# Altium schematic sheet MCU_SoM.SchDoc
size A2; SheetNumber: 12; SheetTotal: 12
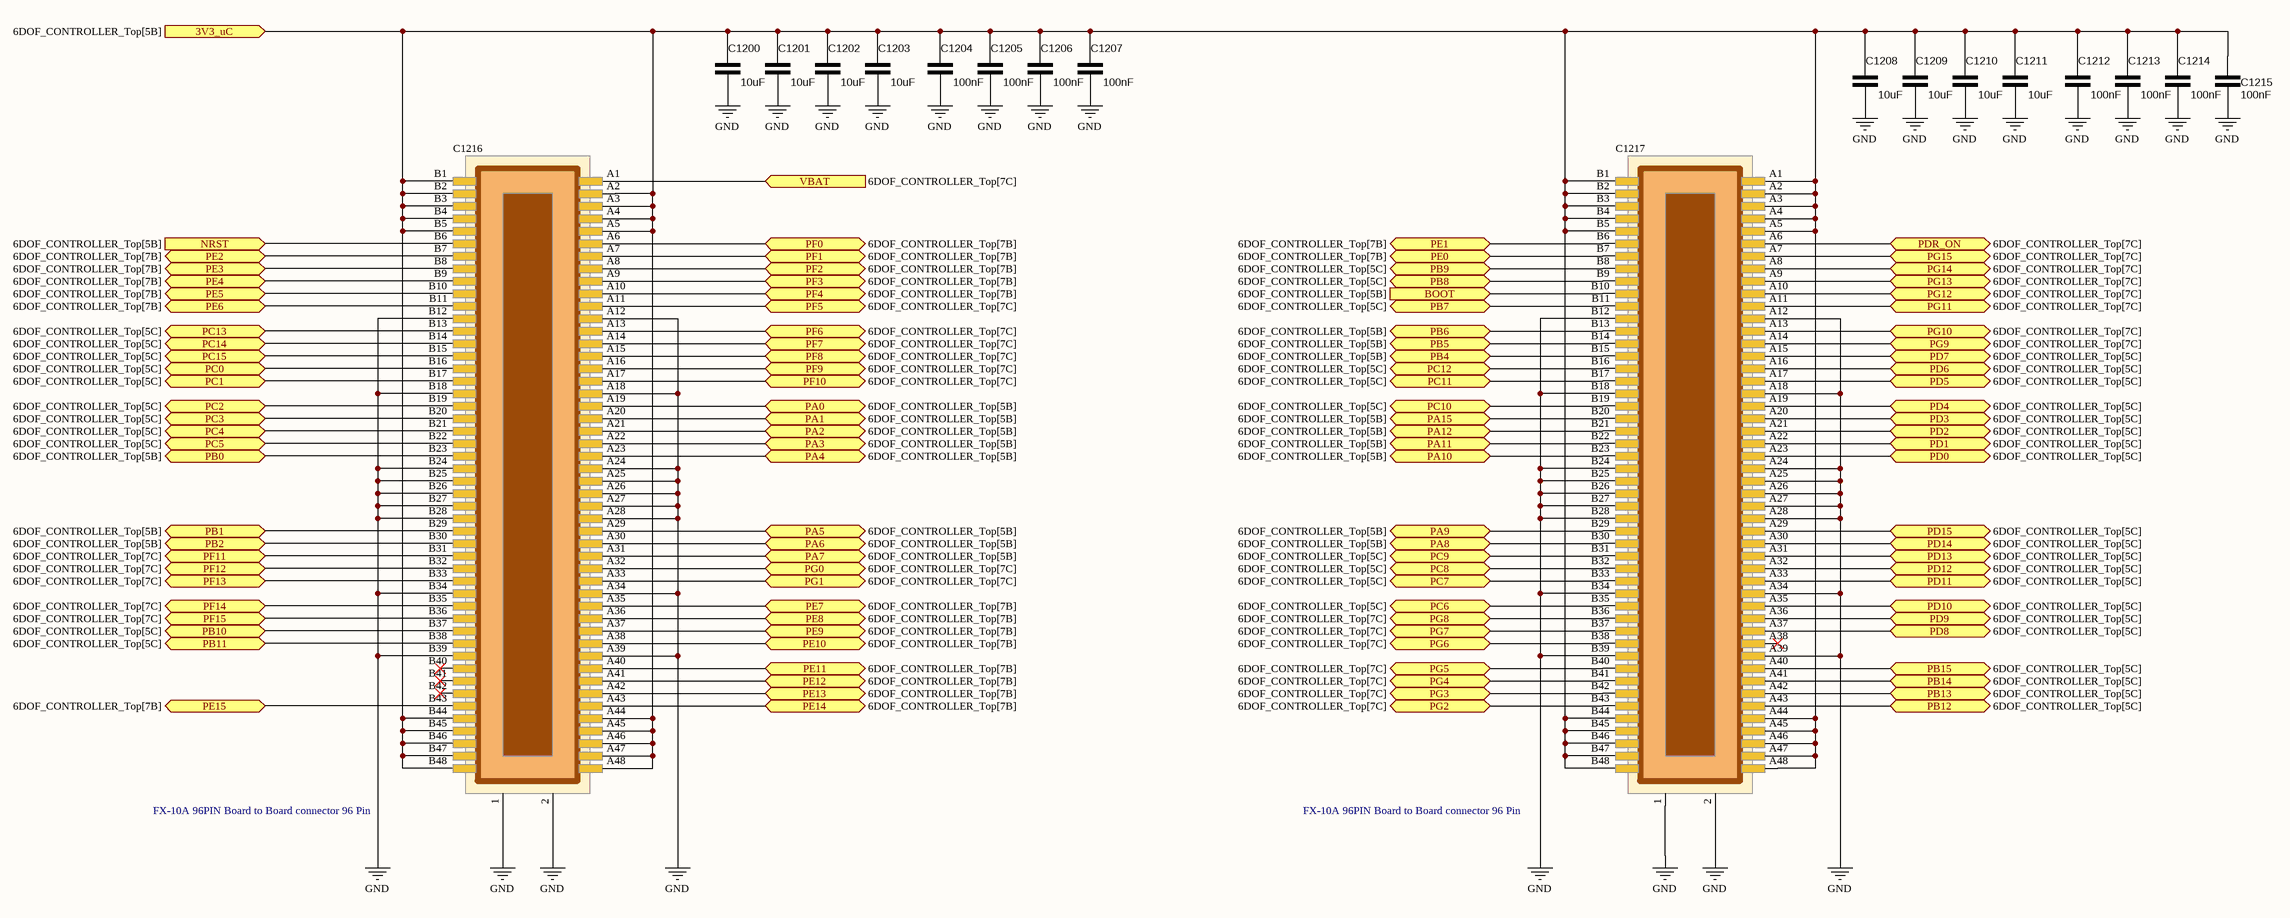
[diagram p0: MCU_SoM.SchDoc]

## Parts
C1200  10uF  [CAP_0805]
C1201  10uF  [CAP_0805]
C1202  10uF  [CAP_0805]
C1203  10uF  [CAP_0805]
C1204  100nF  [CAP_0603]
C1205  100nF  [CAP_0603]
C1206  100nF  [CAP_0603]
C1207  100nF  [CAP_0603]
C1208  10uF  [CAP_0805]
C1209  10uF  [CAP_0805]
C1210  10uF  [CAP_0805]
C1211  10uF  [CAP_0805]
C1212  100nF  [CAP_0603]
C1213  100nF  [CAP_0603]
C1214  100nF  [CAP_0603]
C1215  100nF  [CAP_0603]
C1216  FX-10A 96PIN Board to Board connector 96 Pin  [Board To Board Connector - Female]
C1217  FX-10A 96PIN Board to Board connector 96 Pin  [Board To Board Connector - Female]

## Ports
3V3_uC (in, see 6DOF_CONTROLLER_Top[5B]), BOOT (in, see 6DOF_CONTROLLER_Top[5B]), NRST (in, see 6DOF_CONTROLLER_Top[5B]), PA0 (bidir, see 6DOF_CONTROLLER_Top[5B]), PA1 (bidir, see 6DOF_CONTROLLER_Top[5B]), PA2 (bidir, see 6DOF_CONTROLLER_Top[5B]), PA3 (bidir, see 6DOF_CONTROLLER_Top[5B]), PA4 (bidir, see 6DOF_CONTROLLER_Top[5B]), PA5 (bidir, see 6DOF_CONTROLLER_Top[5B]), PA6 (bidir, see 6DOF_CONTROLLER_Top[5B]), PA7 (bidir, see 6DOF_CONTROLLER_Top[5B]), PA8 (bidir, see 6DOF_CONTROLLER_Top[5B]), PA9 (bidir, see 6DOF_CONTROLLER_Top[5B]), PA10 (bidir, see 6DOF_CONTROLLER_Top[5B]), PA11 (bidir, see 6DOF_CONTROLLER_Top[5B]), PA12 (bidir, see 6DOF_CONTROLLER_Top[5B]), PA15 (bidir, see 6DOF_CONTROLLER_Top[5B]), PB0 (bidir, see 6DOF_CONTROLLER_Top[5B]), PB1 (bidir, see 6DOF_CONTROLLER_Top[5B]), PB2 (bidir, see 6DOF_CONTROLLER_Top[5B]), PB4 (bidir, see 6DOF_CONTROLLER_Top[5B]), PB5 (bidir, see 6DOF_CONTROLLER_Top[5B]), PB6 (bidir, see 6DOF_CONTROLLER_Top[5B]), PB7 (bidir, see 6DOF_CONTROLLER_Top[5C]), PB8 (bidir, see 6DOF_CONTROLLER_Top[5C]), PB9 (bidir, see 6DOF_CONTROLLER_Top[5C]), PB10 (bidir, see 6DOF_CONTROLLER_Top[5C]), PB11 (bidir, see 6DOF_CONTROLLER_Top[5C]), PB12 (bidir, see 6DOF_CONTROLLER_Top[5C]), PB13 (bidir, see 6DOF_CONTROLLER_Top[5C]), PB14 (bidir, see 6DOF_CONTROLLER_Top[5C]), PB15 (bidir, see 6DOF_CONTROLLER_Top[5C]), PC0 (bidir, see 6DOF_CONTROLLER_Top[5C]), PC1 (bidir, see 6DOF_CONTROLLER_Top[5C]), PC2 (bidir, see 6DOF_CONTROLLER_Top[5C]), PC3 (bidir, see 6DOF_CONTROLLER_Top[5C]), PC4 (bidir, see 6DOF_CONTROLLER_Top[5C]), PC5 (bidir, see 6DOF_CONTROLLER_Top[5C]), PC6 (bidir, see 6DOF_CONTROLLER_Top[5C]), PC7 (bidir, see 6DOF_CONTROLLER_Top[5C]), PC8 (bidir, see 6DOF_CONTROLLER_Top[5C]), PC9 (bidir, see 6DOF_CONTROLLER_Top[5C]), PC10 (bidir, see 6DOF_CONTROLLER_Top[5C]), PC11 (bidir, see 6DOF_CONTROLLER_Top[5C]), PC12 (bidir, see 6DOF_CONTROLLER_Top[5C]), PC13 (bidir, see 6DOF_CONTROLLER_Top[5C]), PC14 (bidir, see 6DOF_CONTROLLER_Top[5C]), PC15 (bidir, see 6DOF_CONTROLLER_Top[5C]), PD0 (bidir, see 6DOF_CONTROLLER_Top[5C]), PD1 (bidir, see 6DOF_CONTROLLER_Top[5C]), PD2 (bidir, see 6DOF_CONTROLLER_Top[5C]), PD3 (bidir, see 6DOF_CONTROLLER_Top[5C]), PD4 (bidir, see 6DOF_CONTROLLER_Top[5C]), PD5 (bidir, see 6DOF_CONTROLLER_Top[5C]), PD6 (bidir, see 6DOF_CONTROLLER_Top[5C]), PD7 (bidir, see 6DOF_CONTROLLER_Top[5C]), PD8 (bidir, see 6DOF_CONTROLLER_Top[5C]), PD9 (bidir, see 6DOF_CONTROLLER_Top[5C]), PD10 (bidir, see 6DOF_CONTROLLER_Top[5C]), PD11 (bidir, see 6DOF_CONTROLLER_Top[5C]), PD12 (bidir, see 6DOF_CONTROLLER_Top[5C]), PD13 (bidir, see 6DOF_CONTROLLER_Top[5C]), PD14 (bidir, see 6DOF_CONTROLLER_Top[5C]), PD15 (bidir, see 6DOF_CONTROLLER_Top[5C]), PDR_ON (bidir, see 6DOF_CONTROLLER_Top[7C]), PE0 (bidir, see 6DOF_CONTROLLER_Top[7B]), PE1 (bidir, see 6DOF_CONTROLLER_Top[7B]), PE2 (bidir, see 6DOF_CONTROLLER_Top[7B]), PE3 (bidir, see 6DOF_CONTROLLER_Top[7B]), PE4 (bidir, see 6DOF_CONTROLLER_Top[7B]), PE5 (bidir, see 6DOF_CONTROLLER_Top[7B]), PE6 (bidir, see 6DOF_CONTROLLER_Top[7B]), PE7 (bidir, see 6DOF_CONTROLLER_Top[7B]), PE8 (bidir, see 6DOF_CONTROLLER_Top[7B]), PE9 (bidir, see 6DOF_CONTROLLER_Top[7B]), PE10 (bidir, see 6DOF_CONTROLLER_Top[7B]), PE11 (bidir, see 6DOF_CONTROLLER_Top[7B]), PE12 (bidir, see 6DOF_CONTROLLER_Top[7B]), PE13 (bidir, see 6DOF_CONTROLLER_Top[7B]), PE14 (bidir, see 6DOF_CONTROLLER_Top[7B]), PE15 (bidir, see 6DOF_CONTROLLER_Top[7B]), PF0 (bidir, see 6DOF_CONTROLLER_Top[7B]), PF1 (bidir, see 6DOF_CONTROLLER_Top[7B]), PF2 (bidir, see 6DOF_CONTROLLER_Top[7B]), PF3 (bidir, see 6DOF_CONTROLLER_Top[7B]), PF4 (bidir, see 6DOF_CONTROLLER_Top[7B]), PF5 (bidir, see 6DOF_CONTROLLER_Top[7C]), PF6 (bidir, see 6DOF_CONTROLLER_Top[7C]), PF7 (bidir, see 6DOF_CONTROLLER_Top[7C]), PF8 (bidir, see 6DOF_CONTROLLER_Top[7C]), PF9 (bidir, see 6DOF_CONTROLLER_Top[7C]), PF10 (bidir, see 6DOF_CONTROLLER_Top[7C]), PF11 (bidir, see 6DOF_CONTROLLER_Top[7C]), PF12 (bidir, see 6DOF_CONTROLLER_Top[7C]), PF13 (bidir, see 6DOF_CONTROLLER_Top[7C]), PF14 (bidir, see 6DOF_CONTROLLER_Top[7C]), PF15 (bidir, see 6DOF_CONTROLLER_Top[7C]), PG0 (bidir, see 6DOF_CONTROLLER_Top[7C]), PG1 (bidir, see 6DOF_CONTROLLER_Top[7C]), PG2 (bidir, see 6DOF_CONTROLLER_Top[7C]), PG3 (bidir, see 6DOF_CONTROLLER_Top[7C]), PG4 (bidir, see 6DOF_CONTROLLER_Top[7C]), PG5 (bidir, see 6DOF_CONTROLLER_Top[7C]), PG6 (bidir, see 6DOF_CONTROLLER_Top[7C]), PG7 (bidir, see 6DOF_CONTROLLER_Top[7C]), PG8 (bidir, see 6DOF_CONTROLLER_Top[7C]), PG9 (bidir, see 6DOF_CONTROLLER_Top[7C]), PG10 (bidir, see 6DOF_CONTROLLER_Top[7C]), PG11 (bidir, see 6DOF_CONTROLLER_Top[7C]), PG12 (bidir, see 6DOF_CONTROLLER_Top[7C]), PG13 (bidir, see 6DOF_CONTROLLER_Top[7C]), PG14 (bidir, see 6DOF_CONTROLLER_Top[7C]), PG15 (bidir, see 6DOF_CONTROLLER_Top[7C]), VBAT (in, see 6DOF_CONTROLLER_Top[7C])

## Nets
GND: C1200.1 C1201.1 C1202.1 C1203.1 C1204.1 C1205.1 C1206.1 C1207.1 C1208.1 C1209.1 C1210.1 C1211.1 C1212.1 C1213.1 C1214.1 C1215.1 C1216.1 C1216.2 C1216.A12 C1216.A18 C1216.A24 C1216.A25 C1216.A26 C1216.A27 C1216.A28 C1216.A34 C1216.A39 C1216.B12 C1216.B18 C1216.B24 C1216.B25 C1216.B26 C1216.B27 C1216.B28 C1216.B34 C1216.B39 C1217.1 C1217.2 C1217.A12 C1217.A18 C1217.A24 C1217.A25 C1217.A26 C1217.A27 C1217.A28 C1217.A34 C1217.A39 C1217.B12 C1217.B18 C1217.B24 C1217.B25 C1217.B26 C1217.B27 C1217.B28 C1217.B34 C1217.B39
3V3_uC: C1200.2 C1201.2 C1202.2 C1203.2 C1204.2 C1205.2 C1206.2 C1207.2 C1208.2 C1209.2 C1210.2 C1211.2 C1212.2 C1213.2 C1214.2 C1215.2 C1216.A2 C1216.A3 C1216.A4 C1216.A5 C1216.A44 C1216.A45 C1216.A46 C1216.A47 C1216.A48 C1216.B1 C1216.B2 C1216.B3 C1216.B4 C1216.B5 C1216.B44 C1216.B45 C1216.B46 C1216.B47 C1216.B48 C1217.A1 C1217.A2 C1217.A3 C1217.A4 C1217.A5 C1217.A44 C1217.A45 C1217.A46 C1217.A47 C1217.A48 C1217.B1 C1217.B2 C1217.B3 C1217.B4 C1217.B5 C1217.B44 C1217.B45 C1217.B46 C1217.B47 C1217.B48 ; port 3V3_uC
BOOT: C1217.B10 ; port BOOT
NRST: C1216.B6 ; port NRST
PA0: C1216.A19 ; port PA0
PA1: C1216.A20 ; port PA1
PA2: C1216.A21 ; port PA2
PA3: C1216.A22 ; port PA3
PA4: C1216.A23 ; port PA4
PA5: C1216.A29 ; port PA5
PA6: C1216.A30 ; port PA6
PA7: C1216.A31 ; port PA7
PA8: C1217.B30 ; port PA8
PA9: C1217.B29 ; port PA9
PA10: C1217.B23 ; port PA10
PA11: C1217.B22 ; port PA11
PA12: C1217.B21 ; port PA12
PA15: C1217.B20 ; port PA15
PB0: C1216.B23 ; port PB0
PB1: C1216.B29 ; port PB1
PB2: C1216.B30 ; port PB2
PB4: C1217.B15 ; port PB4
PB5: C1217.B14 ; port PB5
PB6: C1217.B13 ; port PB6
PB7: C1217.B11 ; port PB7
PB8: C1217.B9 ; port PB8
PB9: C1217.B8 ; port PB9
PB10: C1216.B37 ; port PB10
PB11: C1216.B38 ; port PB11
PB12: C1217.A43 ; port PB12
PB13: C1217.A42 ; port PB13
PB14: C1217.A41 ; port PB14
PB15: C1217.A40 ; port PB15
PC0: C1216.B16 ; port PC0
PC1: C1216.B17 ; port PC1
PC2: C1216.B19 ; port PC2
PC3: C1216.B20 ; port PC3
PC4: C1216.B21 ; port PC4
PC5: C1216.B22 ; port PC5
PC6: C1217.B35 ; port PC6
PC7: C1217.B33 ; port PC7
PC8: C1217.B32 ; port PC8
PC9: C1217.B31 ; port PC9
PC10: C1217.B19 ; port PC10
PC11: C1217.B17 ; port PC11
PC12: C1217.B16 ; port PC12
PC13: C1216.B13 ; port PC13
PC14: C1216.B14 ; port PC14
PC15: C1216.B15 ; port PC15
PD0: C1217.A23 ; port PD0
PD1: C1217.A22 ; port PD1
PD2: C1217.A21 ; port PD2
PD3: C1217.A20 ; port PD3
PD4: C1217.A19 ; port PD4
PD5: C1217.A17 ; port PD5
PD6: C1217.A16 ; port PD6
PD7: C1217.A15 ; port PD7
PD8: C1217.A37 ; port PD8
PD9: C1217.A36 ; port PD9
PD10: C1217.A35 ; port PD10
PD11: C1217.A33 ; port PD11
PD12: C1217.A32 ; port PD12
PD13: C1217.A31 ; port PD13
PD14: C1217.A30 ; port PD14
PD15: C1217.A29 ; port PD15
PDR_ON: C1217.A6 ; port PDR_ON
PE0: C1217.B7 ; port PE0
PE1: C1217.B6 ; port PE1
PE2: C1216.B7 ; port PE2
PE3: C1216.B8 ; port PE3
PE4: C1216.B9 ; port PE4
PE5: C1216.B10 ; port PE5
PE6: C1216.B11 ; port PE6
PE7: C1216.A35 ; port PE7
PE8: C1216.A36 ; port PE8
PE9: C1216.A37 ; port PE9
PE10: C1216.A38 ; port PE10
PE11: C1216.A40 ; port PE11
PE12: C1216.A41 ; port PE12
PE13: C1216.A42 ; port PE13
PE14: C1216.A43 ; port PE14
PE15: C1216.B43 ; port PE15
PF0: C1216.A6 ; port PF0
PF1: C1216.A7 ; port PF1
PF2: C1216.A8 ; port PF2
PF3: C1216.A9 ; port PF3
PF4: C1216.A10 ; port PF4
PF5: C1216.A11 ; port PF5
PF6: C1216.A13 ; port PF6
PF7: C1216.A14 ; port PF7
PF8: C1216.A15 ; port PF8
PF9: C1216.A16 ; port PF9
PF10: C1216.A17 ; port PF10
PF11: C1216.B31 ; port PF11
PF12: C1216.B32 ; port PF12
PF13: C1216.B33 ; port PF13
PF14: C1216.B35 ; port PF14
PF15: C1216.B36 ; port PF15
PG0: C1216.A32 ; port PG0
PG1: C1216.A33 ; port PG1
PG2: C1217.B43 ; port PG2
PG3: C1217.B42 ; port PG3
PG4: C1217.B41 ; port PG4
PG5: C1217.B40 ; port PG5
PG6: C1217.B38 ; port PG6
PG7: C1217.B37 ; port PG7
PG8: C1217.B36 ; port PG8
PG9: C1217.A14 ; port PG9
PG10: C1217.A13 ; port PG10
PG11: C1217.A11 ; port PG11
PG12: C1217.A10 ; port PG12
PG13: C1217.A9 ; port PG13
PG14: C1217.A8 ; port PG14
PG15: C1217.A7 ; port PG15
VBAT: C1216.A1 ; port VBAT

Not connected (* = marked no-connect by the designer): C1216 B40(40)* B41(41)* B42(42)*; C1217 A38(38)*

## Library data of the parts
C1200-C1203 C1208-C1211 = C000002: 10 µF ±10% 25V Ceramic Capacitor X5R 0805 (2012 Metric); ComponentLink1Description: DigiKey; ComponentLink1URL: https://www.digikey.com/en/products/detail/tdk-corporation/C2012X5R1E106K125AB/2443462; DigiKey Part Number: 445-5984-1-ND; capacitance: 10uF
C1204-C1207 C1212-C1215 = C000007: 0.1 µF ±10% 25V Ceramic Capacitor X7R 0603 (1608 Metric); ComponentLink1Description: DigiKey; ComponentLink1URL: https://www.digikey.com/en/products/detail/kyocera-avx/06033C104K4T2A/8019250; DigiKey Part Number: 478-KAM15AR71E104KTCT-ND; capacitance: 100nF
C1216 C1217 = 00000016: CONN RCPT 96POS SMD GOLD - FEMALE; Digikey Part Number: H122463-ND; ComponentLink1Description: Digikey; ComponentLink1URL: https://www.digikey.com/en/products/detail/hirose-electric-co-ltd/FX10A-96S-SV/2041894